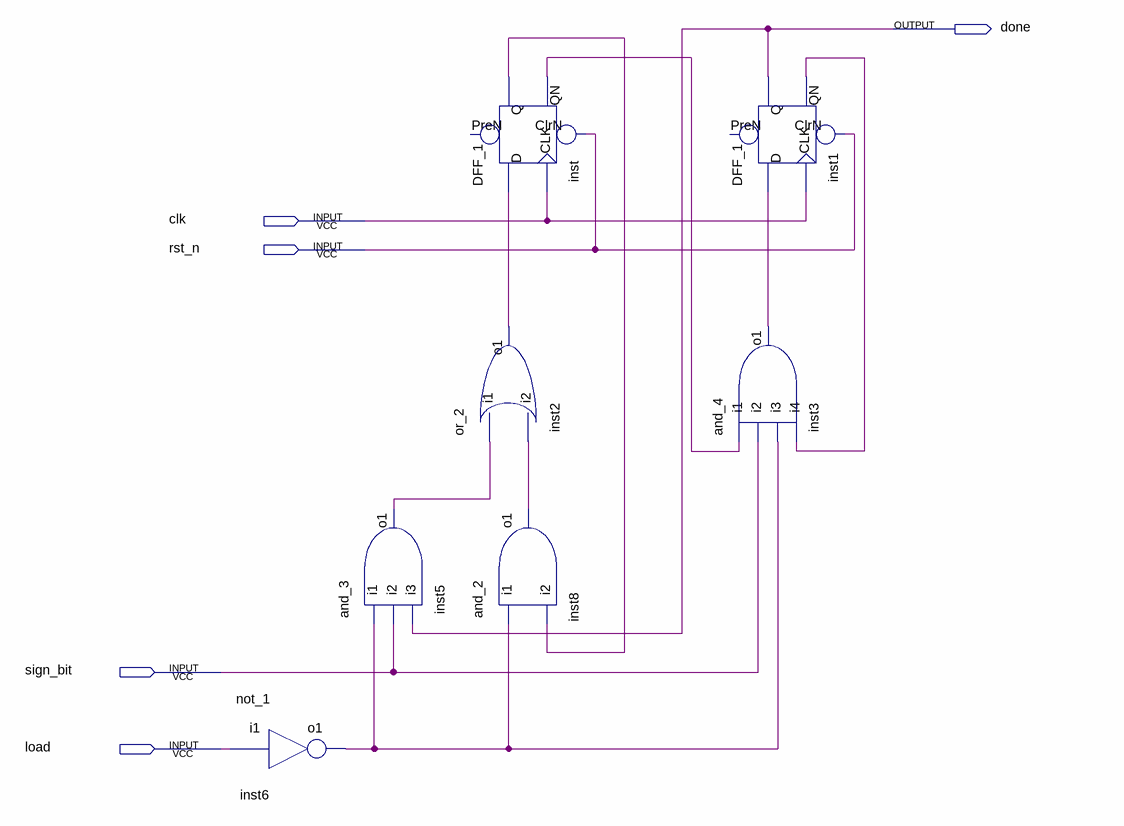
[diagram p0: schematic sheet]
// Quartus schematic Controller.bdf as structural Verilog: 7 symbols, 5 pins
module Controller (
  input  clk,
  input  rst_n,
  input  sign_bit,
  input  load,
  output done
);

  wire inst1_qn, inst2_o1, inst3_o1, inst5_o1, inst6_o1, inst8_o1, inst_q, inst_qn;

  not_1 inst6 (.i1(load), .o1(inst6_o1));
  and_3 inst5 (.i1(inst6_o1), .i2(sign_bit), .i3(done), .o1(inst5_o1));
  DFF_1 inst (.CLK(clk), .D(inst2_o1), .ClrN(rst_n), .QN(inst_qn), .Q(inst_q));  // open: PreN
  or_2 inst2 (.i1(inst5_o1), .i2(inst8_o1), .o1(inst2_o1));
  and_2 inst8 (.i1(inst6_o1), .i2(inst_q), .o1(inst8_o1));
  DFF_1 inst1 (.CLK(clk), .D(inst3_o1), .ClrN(rst_n), .QN(inst1_qn), .Q(done));  // open: PreN
  and_4 inst3 (.i1(inst_qn), .i2(sign_bit), .i3(inst6_o1), .i4(inst1_qn), .o1(inst3_o1));
endmodule
